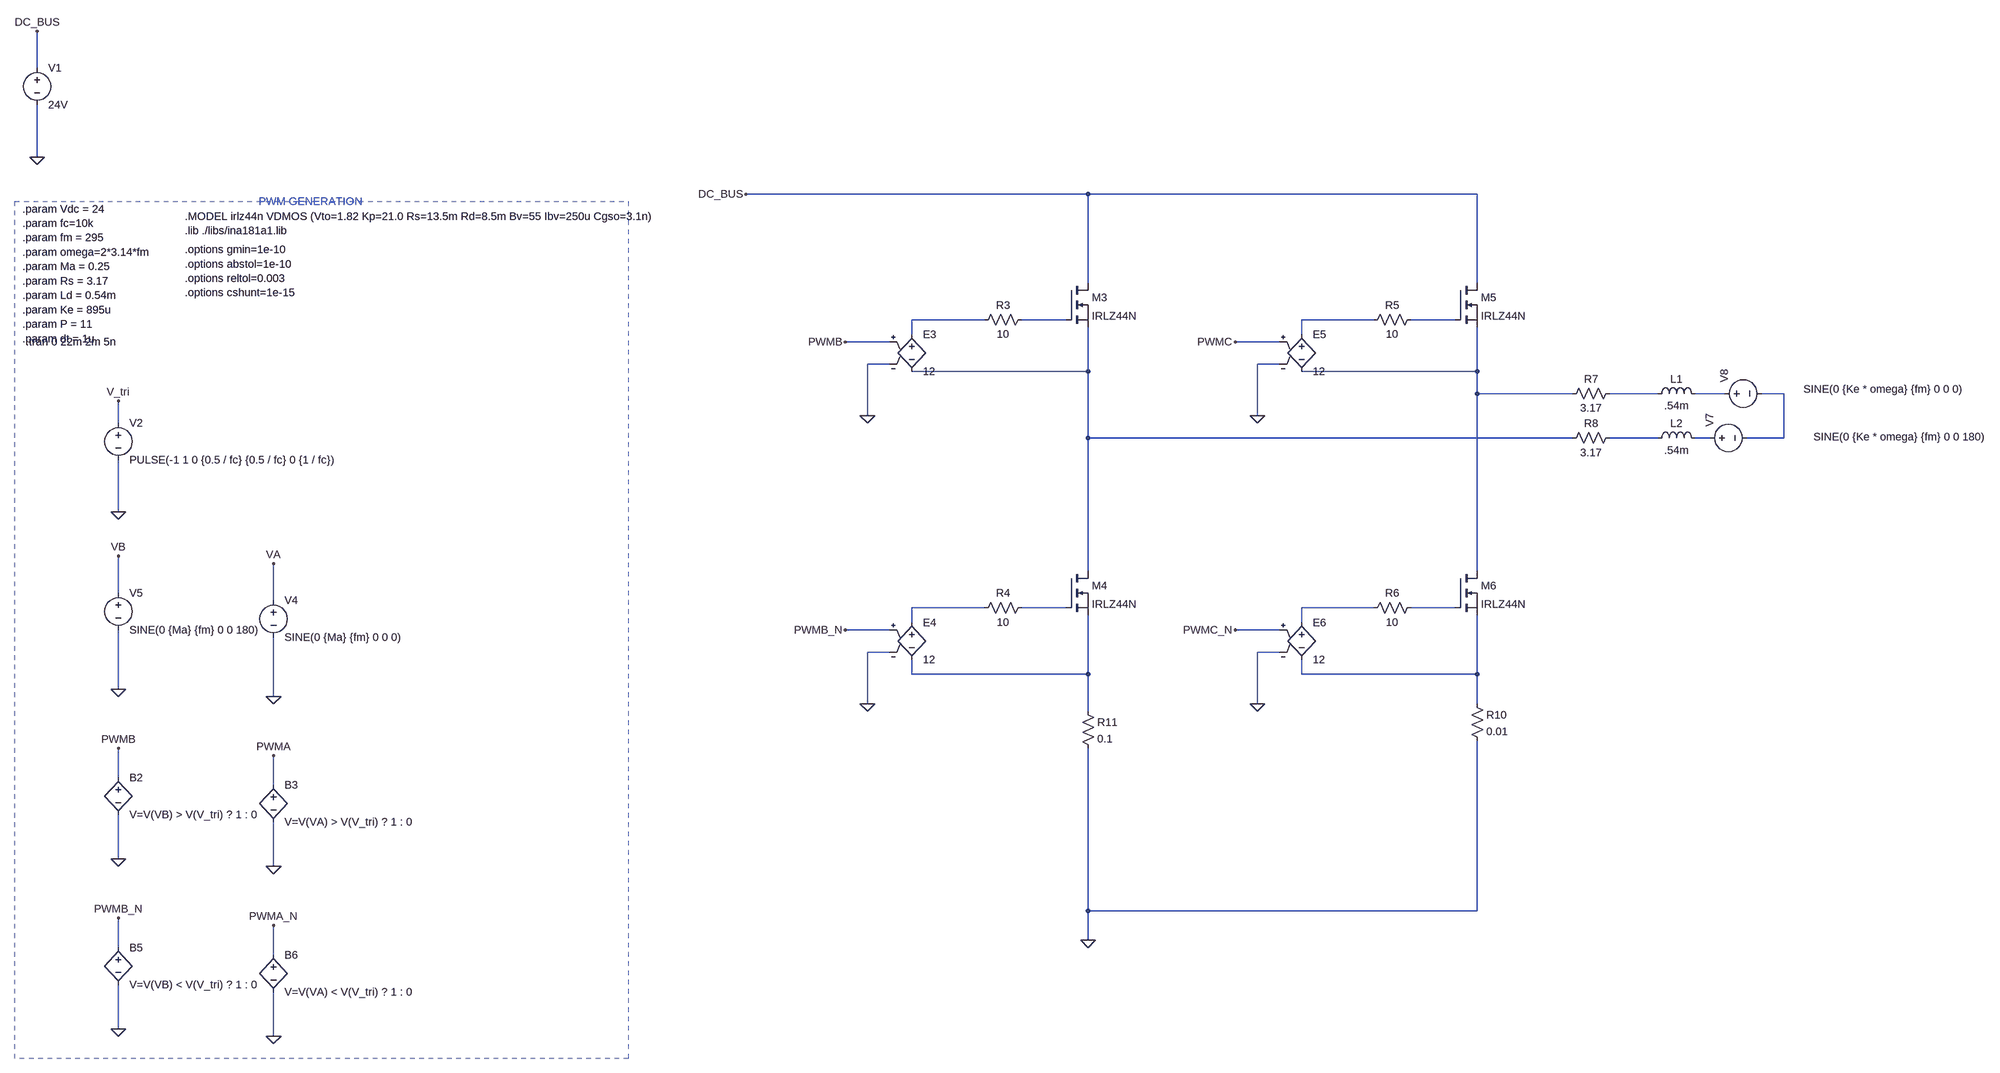
[diagram p0: schematic single_phase_switching.asc]
single_phase_switching.asc, the LTspice schematic file:
Version 4
SHEET 1 6180 2884
WIRE -192 368 -192 288
WIRE -192 608 -192 448
WIRE 3584 688 1776 688
WIRE 4560 688 3584 688
WIRE 3584 880 3584 688
WIRE 4560 880 4560 688
WIRE 3360 960 3152 960
WIRE 3536 960 3440 960
WIRE 4336 960 4128 960
WIRE 4512 960 4416 960
WIRE 3152 992 3152 960
WIRE 4128 992 4128 960
WIRE 3104 1008 3008 1008
WIRE 4080 1008 3984 1008
WIRE 3104 1056 3056 1056
WIRE 4080 1056 4032 1056
WIRE 3584 1072 3584 976
WIRE 3584 1072 3152 1072
WIRE 4560 1072 4560 976
WIRE 4560 1072 4128 1072
WIRE 4560 1120 4560 1072
WIRE 5008 1120 4560 1120
WIRE 5200 1120 5088 1120
WIRE 5344 1120 5280 1120
WIRE 5472 1120 5424 1120
WIRE 3056 1168 3056 1056
WIRE 4032 1168 4032 1056
WIRE -16 1184 -16 1136
WIRE 3584 1216 3584 1072
WIRE 5008 1216 3584 1216
WIRE 5200 1216 5088 1216
WIRE 5312 1216 5280 1216
WIRE 5472 1216 5472 1120
WIRE 5472 1216 5392 1216
WIRE -16 1376 -16 1264
WIRE 3584 1504 3584 1216
WIRE 4560 1504 4560 1120
WIRE -16 1552 -16 1472
WIRE 320 1568 320 1488
WIRE 3360 1584 3152 1584
WIRE 3536 1584 3440 1584
WIRE 4336 1584 4128 1584
WIRE 4512 1584 4416 1584
WIRE 3152 1616 3152 1584
WIRE 4128 1616 4128 1584
WIRE 3104 1632 3008 1632
WIRE 4080 1632 3984 1632
WIRE 3104 1680 3056 1680
WIRE 4080 1680 4032 1680
WIRE 3152 1728 3152 1696
WIRE 3584 1728 3584 1600
WIRE 3584 1728 3152 1728
WIRE 4128 1728 4128 1696
WIRE 4560 1728 4560 1600
WIRE 4560 1728 4128 1728
WIRE -16 1760 -16 1632
WIRE 320 1776 320 1648
WIRE 3056 1792 3056 1680
WIRE 4032 1792 4032 1680
WIRE 4560 1792 4560 1728
WIRE 3584 1808 3584 1728
WIRE -16 1952 -16 1888
WIRE 320 1968 320 1904
WIRE -16 2128 -16 2032
WIRE 320 2144 320 2048
WIRE 3584 2240 3584 1888
WIRE 4560 2240 4560 1872
WIRE 4560 2240 3584 2240
WIRE 3584 2304 3584 2240
WIRE -16 2320 -16 2256
WIRE 320 2336 320 2272
WIRE -16 2496 -16 2400
WIRE 320 2512 320 2416
FLAG -16 1136 V_tri
FLAG -16 1376 0
FLAG 320 1776 0
FLAG 320 1488 VA
FLAG -16 1760 0
FLAG -16 1472 VB
FLAG -16 2128 0
FLAG -16 1888 PWMB
FLAG 320 2144 0
FLAG 320 1904 PWMA
FLAG -16 2496 0
FLAG -16 2256 PWMB_N
FLAG 320 2512 0
FLAG 320 2272 PWMA_N
FLAG -192 608 0
FLAG -192 288 DC_BUS
FLAG 1776 688 DC_BUS
FLAG 3056 1168 0
FLAG 3008 1008 PWMB
FLAG 3056 1792 0
FLAG 3008 1632 PWMB_N
FLAG 4032 1168 0
FLAG 3984 1008 PWMC
FLAG 4032 1792 0
FLAG 3984 1632 PWMC_N
FLAG 3584 2304 0
SYMBOL voltage -16 1168 R0
WINDOW 123 0 0 Left 0
WINDOW 39 0 0 Left 0
SYMATTR InstName V2
SYMATTR Value PULSE(-1 1 0 {0.5 / fc} {0.5 / fc} 0 {1 / fc})
SYMBOL voltage 320 1552 R0
WINDOW 123 0 0 Left 0
WINDOW 39 0 0 Left 0
SYMATTR InstName V4
SYMATTR Value SINE(0 {Ma} {fm} 0 0 0)
SYMBOL voltage -16 1536 R0
WINDOW 123 0 0 Left 0
WINDOW 39 0 0 Left 0
SYMATTR InstName V5
SYMATTR Value SINE(0 {Ma} {fm} 0 0 180)
SYMBOL bv -16 1936 R0
SYMATTR InstName B2
SYMATTR Value V=V(VB) > V(V_tri) ? 1 : 0
SYMBOL bv 320 1952 R0
SYMATTR InstName B3
SYMATTR Value V=V(VA) > V(V_tri) ? 1 : 0
SYMBOL bv -16 2304 R0
SYMATTR InstName B5
SYMATTR Value V=V(VB) < V(V_tri) ? 1 : 0
SYMBOL bv 320 2320 R0
SYMATTR InstName B6
SYMATTR Value V=V(VA) < V(V_tri) ? 1 : 0
SYMBOL voltage -192 352 R0
WINDOW 123 0 0 Left 0
WINDOW 39 0 0 Left 0
SYMATTR InstName V1
SYMATTR Value 24V
SYMBOL e 3152 976 R0
SYMATTR InstName E3
SYMATTR Value 12
SYMBOL res 3456 944 R90
WINDOW 0 0 56 VBottom 2
WINDOW 3 32 56 VTop 2
SYMATTR InstName R3
SYMATTR Value 10
SYMBOL nmos 3536 880 R0
SYMATTR InstName M3
SYMATTR Value IRLZ44N
SYMBOL e 3152 1600 R0
SYMATTR InstName E4
SYMATTR Value 12
SYMBOL res 3456 1568 R90
WINDOW 0 0 56 VBottom 2
WINDOW 3 32 56 VTop 2
SYMATTR InstName R4
SYMATTR Value 10
SYMBOL nmos 3536 1504 R0
SYMATTR InstName M4
SYMATTR Value IRLZ44N
SYMBOL e 4128 976 R0
SYMATTR InstName E5
SYMATTR Value 12
SYMBOL res 4432 944 R90
WINDOW 0 0 56 VBottom 2
WINDOW 3 32 56 VTop 2
SYMATTR InstName R5
SYMATTR Value 10
SYMBOL nmos 4512 880 R0
SYMATTR InstName M5
SYMATTR Value IRLZ44N
SYMBOL e 4128 1600 R0
SYMATTR InstName E6
SYMATTR Value 12
SYMBOL res 4432 1568 R90
WINDOW 0 0 56 VBottom 2
WINDOW 3 32 56 VTop 2
SYMATTR InstName R6
SYMATTR Value 10
SYMBOL nmos 4512 1504 R0
SYMATTR InstName M6
SYMATTR Value IRLZ44N
SYMBOL res 5104 1104 R90
WINDOW 0 0 56 VBottom 2
WINDOW 3 32 56 VTop 2
SYMATTR InstName R7
SYMATTR Value 3.17
SYMBOL ind 5184 1136 R270
WINDOW 0 32 56 VTop 2
WINDOW 3 5 56 VBottom 2
SYMATTR InstName L1
SYMATTR Value .54m
SYMBOL res 5104 1200 R90
WINDOW 0 0 56 VBottom 2
WINDOW 3 32 56 VTop 2
SYMATTR InstName R8
SYMATTR Value 3.17
SYMBOL ind 5184 1232 R270
WINDOW 0 32 56 VTop 2
WINDOW 3 5 56 VBottom 2
SYMATTR InstName L2
SYMATTR Value .54m
SYMBOL res 4544 1776 R0
SYMATTR InstName R10
SYMATTR Value 0.01
SYMBOL res 3568 1792 R0
SYMATTR InstName R11
SYMATTR Value 0.1
SYMBOL voltage 5296 1216 R270
WINDOW 123 0 0 Left 0
WINDOW 39 0 0 Left 0
WINDOW 3 2 240 VRight 2
SYMATTR Value SINE(0 {Ke * omega} {fm} 0 0 180)
SYMATTR InstName V7
SYMBOL voltage 5328 1120 R270
WINDOW 123 0 0 Left 0
WINDOW 39 0 0 Left 0
WINDOW 3 10 187 VRight 2
SYMATTR Value SINE(0 {Ke * omega} {fm} 0 0 0)
SYMATTR InstName V8
TEXT -224 720 Left 2 !.param Vdc = 24\n.param fc=10k\n.param fm = 295\n.param omega=2*3.14*fm\n.param Ma = 0.25\n.param Rs = 3.17\n.param Ld = 0.54m\n.param Ke = 895u\n.param P = 11\n.param dt = 1u
TEXT -216 1008 Left 2 !.tran 0 22m 2m 5n
TEXT 288 704 Left 2 ;PWM GENERATION
TEXT 128 736 Left 2 !.MODEL irlz44n VDMOS (Vto=1.82 Kp=21.0 Rs=13.5m Rd=8.5m Bv=55 Ibv=250u Cgso=3.1n)\n.lib ./libs/ina181a1.lib
TEXT 128 808 Left 2 !.options gmin=1e-10\n.options abstol=1e-10\n.options reltol=0.003\n.options cshunt=1e-15
RECTANGLE Normal 1088 2560 -240 704 2

The netlist it stands for:
* single_phase_switching.asc
V2 V_tri 0 PULSE(-1 1 0 {0.5 / fc} {0.5 / fc} 0 {1 / fc})
V4 VA 0 SINE(0 {Ma} {fm} 0 0 0)
V5 VB 0 SINE(0 {Ma} {fm} 0 0 180)
B2 PWMB 0 V=V(VB) > V(V_tri) ? 1 : 0
B3 PWMA 0 V=V(VA) > V(V_tri) ? 1 : 0
B5 PWMB_N 0 V=V(VB) < V(V_tri) ? 1 : 0
B6 PWMA_N 0 V=V(VA) < V(V_tri) ? 1 : 0
V1 DC_BUS 0 24V
E3 N001 N005 PWMB 0 12
R3 N002 N001 10
M3 DC_BUS N002 N005 N005 IRLZ44N
E4 N012 N016 PWMB_N 0 12
R4 N013 N012 10
M4 N005 N013 N016 N016 IRLZ44N
E5 N003 N006 PWMC 0 12
R5 N004 N003 10
M5 DC_BUS N004 N006 N006 IRLZ44N
E6 N014 N017 PWMC_N 0 12
R6 N015 N014 10
M6 N006 N015 N017 N017 IRLZ44N
R7 N007 N006 3.17
L1 N007 N008 .54m
R8 N010 N005 3.17
L2 N010 N011 .54m
R10 N017 0 0.01
R11 N016 0 0.1
V7 N011 N009 SINE(0 {Ke * omega} {fm} 0 0 180)
V8 N008 N009 SINE(0 {Ke * omega} {fm} 0 0 0)
.model NMOS NMOS
.model PMOS PMOS
.lib standard.mos
.param Vdc = 24
.param fc=10k
.param fm = 295
.param omega=2*3.14*fm
.param Ma = 0.25
.param Rs = 3.17
.param Ld = 0.54m
.param Ke = 895u
.param P = 11
.param dt = 1u
.tran 0 22m 2m 5n
* PWM GENERATION
.MODEL irlz44n VDMOS (Vto=1.82 Kp=21.0 Rs=13.5m Rd=8.5m Bv=55 Ibv=250u Cgso=3.1n)
.lib ./libs/ina181a1.lib
.options gmin=1e-10
.options abstol=1e-10
.options reltol=0.003
.options cshunt=1e-15
.backanno
.end